# Altium schematic sheet DacAmpl.SchDoc
size A4
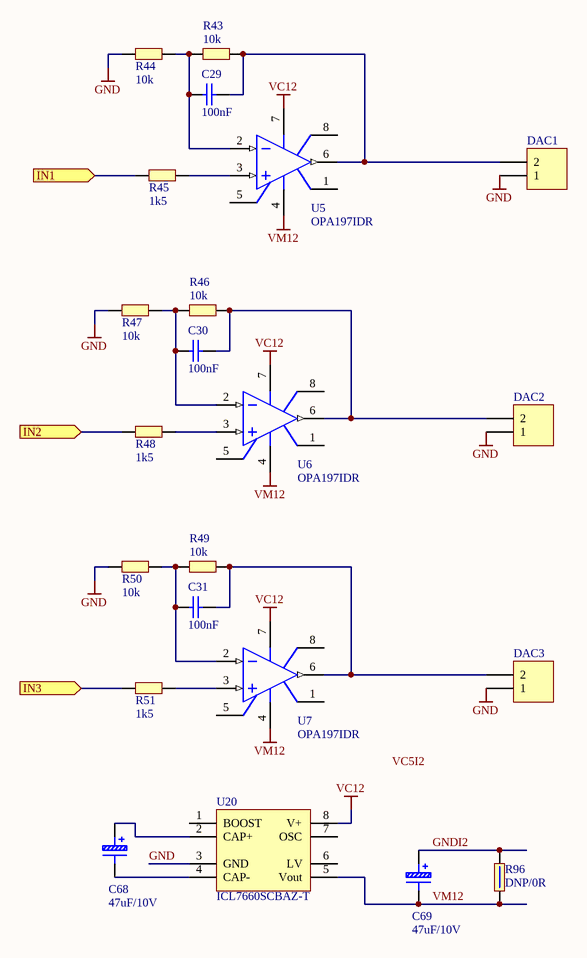
[diagram p0: DacAmpl.SchDoc]

## Parts
C29  100nF  [0603C]
C30  100nF  [0603C]
C31  100nF  [0603C]
C68  47uF/10V  [CAP_C]
C69  47uF/10V  [CAP_C]
DAC1  Header 2  [JST-B2B-XH-A]  (value not drawn)
DAC2  Header 2  [JST-B2B-XH-A]  (value not drawn)
DAC3  Header 2  [JST-B2B-XH-A]  (value not drawn)
R43  10k  [0603R]
R44  10k  [0603R]
R45  1k5  [0603R]
R46  10k  [0603R]
R47  10k  [0603R]
R48  1k5  [0603R]
R49  10k  [0603R]
R50  10k  [0603R]
R51  1k5  [0603R]
R96  DNP/0R  [0603R]
U5  OPA197IDR  [SO8]
U6  OPA197IDR  [SO8]
U7  OPA197IDR  [SO8]
U20  ICL7660SCBAZ-T  [SO8]

## Ports
IN1 (in), IN2 (in), IN3 (in)

## Nets
GND: DAC1.1 DAC2.1 DAC3.1 R44.1 R47.1 R50.1 U20.3(GND)
VC12: U5.7(V+) U6.7(V+) U7.7(V+) U20.8(V+)
VM12: C69.1 R96.2 U5.4(V-) U6.4(V-) U7.4(V-) U20.5(Vout)
GNDI2: C69.2 R96.1
IN1: R45.1 ; port IN1
IN2: R48.1 ; port IN2
IN3: R51.1 ; port IN3
NetC29_1: C29.1 DAC1.2 R43.2 U5.6(OUT)
NetC29_2: C29.2 R43.1 R44.2 U5.2(IN-)
NetC30_1: C30.1 DAC2.2 R46.2 U6.6(OUT)
NetC30_2: C30.2 R46.1 R47.2 U6.2(IN-)
NetC31_1: C31.1 DAC3.2 R49.2 U7.6(OUT)
NetC31_2: C31.2 R49.1 R50.2 U7.2(IN-)
NetC68_1: C68.1 U20.4(CAP-)
NetC68_2: C68.2 U20.2(CAP+)
NetR45_2: R45.2 U5.3(IN+)
NetR48_2: R48.2 U6.3(IN+)
NetR51_2: R51.2 U7.3(IN+)

Not connected (* = marked no-connect by the designer): U5 1(OS_NUL) 5(OS_NUL) 8(TAB); U6 1(OS_NUL) 5(OS_NUL) 8(TAB); U7 1(OS_NUL) 5(OS_NUL) 8(TAB); U20 1(BOOST) 6(LV) 7(OSC)

## Notes on the sheet
- Labels drawn without touching a wire or pin: VC5I2

## Library data of the parts
C29-C31 = Cap_100nF_X7R_10%_0402: Capacitor,100nF,16V,X7R,10%,0402,YAGEO; Manuf_Part_1: CC0402KRX7R7BB104; Revision: July-2002: Re-released for DXP Platform.; Value: 100nF; Order: CC0402KRX7R7BB104; Manuf_1: YAGEO
C68 C69 = CapTantal
DAC1-DAC3 = Header 2: Header, 2-Pin; LatestRevisionDate: 17-Jul-2002; LatestRevisionNote: Re-released for DXP Platform.; Publisher: Altium Limited
R43-R51 = RES3
R96 = RES3Z
U5-U7 = Op Amp: FET Operational Amplifier; Published: 8-Jun-2000; LatestRevisionDate: 17-Jul-2002; LatestRevisionNote: Re-released for DXP Platform.; DatasheetVersion: REV. B; PackageVersion: 1990; PackageReference: H-08A; Publisher: Altium Limited; PackageDescription: Can; 8 Leads; Pin Circle Dia. 5.08 mm; Lead Dia. 0.53 mm (max); ComponentLink1Description: Manufacturer Link; ComponentLink1URL: http://www.analog.com/
U20 = ICL7660